# EAGLE design mw_itb_half_v1.7.2 (EAGLE 6.4)
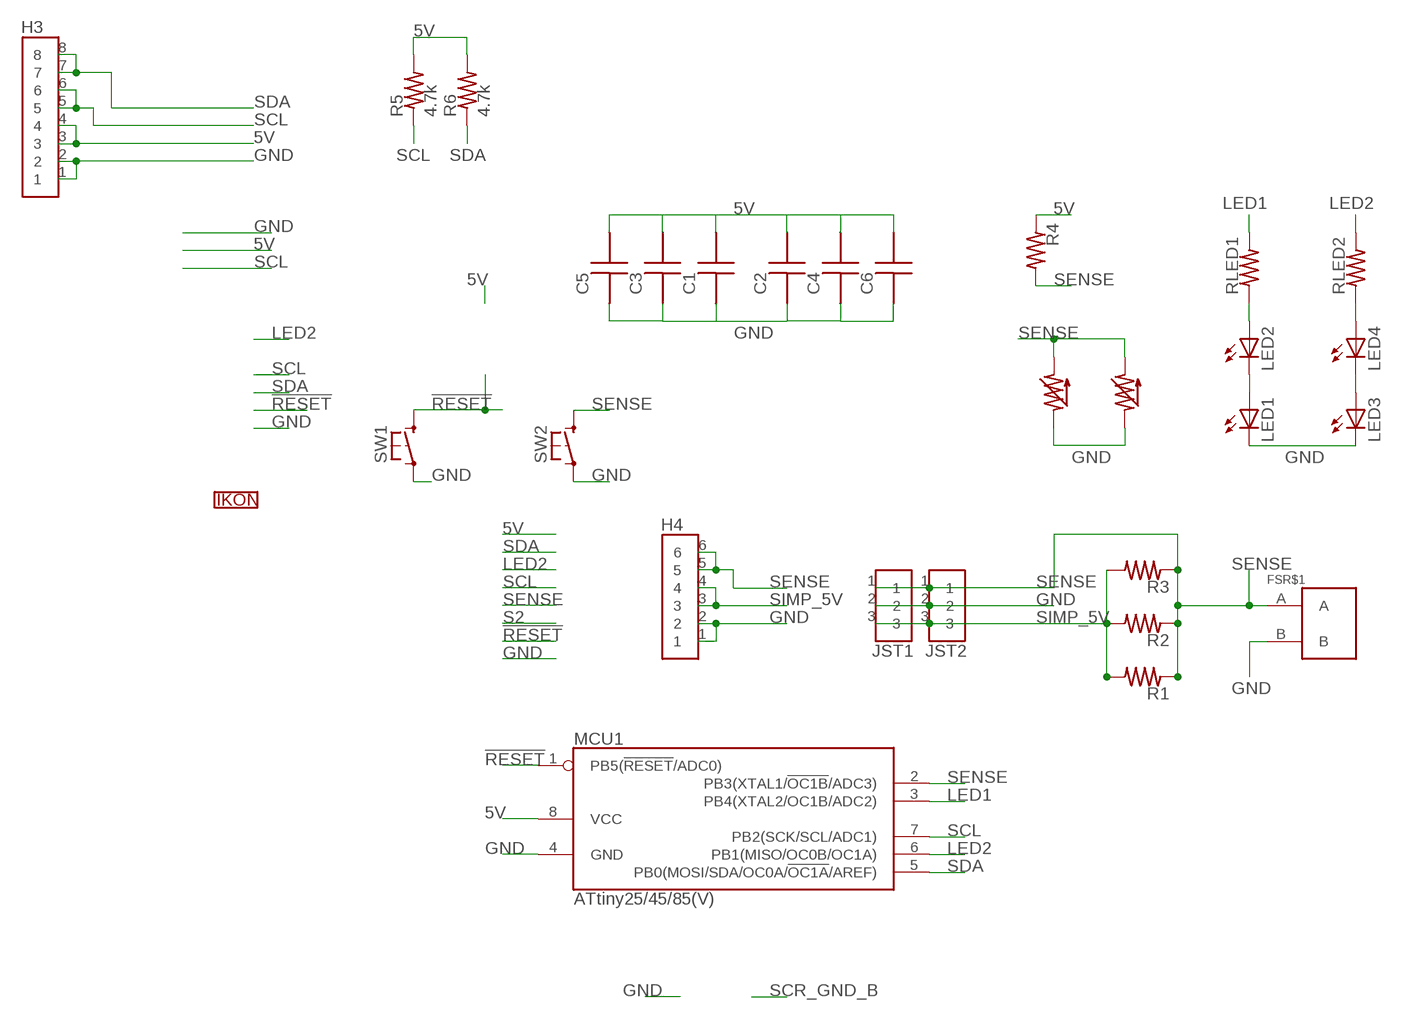
[diagram p0: schematic, sheet 1]

## Parts
C1  CAPACITOR1206  [1206_YAGEO]
C2  CAPACITOR1206  [1206_YAGEO]
C3  CAPACITOR0805  [0805_YAGEO]
C4  CAPACITOR0805  [0805_YAGEO]
C5  CAPACITOR0603  [0603_YAGEO]
C6  CAPACITOR0603  [0603_YAGEO]
FSR$1  FSR_PAD88X44_P2B  [FSR_PAD_88X44_P2B]
H3  HEADER_8P-0.1"_2X4-SMD-SULLINS  [HEADER-0.1"_2X4-SMD-SULLINS]
H4  HEADER_6P-0.1"_2X3-SMD-SULLINS  [HEADER-0.1"_2X3-SMD-SULLINS]
JST1  JST-3-PH-SMD-TOP  [JST_PH_SMD_3_TOP]
JST2  JST-3-PH-SMD-TOP  [JST_PH_SMD_3_TOP]
LED1  LED-ZBEND_RM  [Z-BEND_RM]
LED2  LED-ZBEND_RM  [Z-BEND_RM]
LED3  LED-ZBEND_RM  [Z-BEND_RM]
LED4  LED-ZBEND_RM  [Z-BEND_RM]
MCU1  ATMEL_ATTINY25/45/85(V)-SOIC_DUAL  [SOIC-8_DUAL]
R1  RESISTOR1206  [1206_YAGEO]
R2  RESISTOR0805  [0805_YAGEO]
R3  RESISTOR0603  [0603_YAGEO]
R4  RESISTOR0603  [0603_YAGEO]
R5  4.7k  RESISTOR0603  [0603_YAGEO]
R6  4.7k  RESISTOR0603  [0603_YAGEO]
RLED1  RESISTOR0603  [0603_YAGEO]
RLED2  RESISTOR0603  [0603_YAGEO]
SW1  SWITCH_SPST-KMT0  [KMT0]
SW2  SWITCH_SPST-KMT0  [KMT0]
U$5  FSR_PLACE  FSR_PLACE1.5"SQR  [FSR_1.5[IN]_SQR]
U$6  FSR_PLACE  FSR_PLACE1.5"SQR  [FSR_1.5[IN]_SQR]
U$9  FSR_PINS  FSR_PINSJUMBO_SMD  [FSR_0.1"-PITCH_PADS-0.05"X0.5"]
U$10  FSR_PINS  FSR_PINSJUMBO_SMD  [FSR_0.1"-PITCH_PADS-0.05"X0.5"]
U$11  IKONLEARNING-20MIL  [IKON_LEARNING_20MIL]

## Nets
5V: C1.1 C2.1 C3.1 C4.1 C5.1 C6.1 H3.3 H3.4 MCU1.8(VCC) R4.1 R5.2 R6.2
!RESET: MCU1.1(PB5(!RESET!/ADC0)) SW1.1@1 SW1.1@2
GND: C1.2 C2.2 C3.2 C4.2 C5.2 C6.2 FSR$1.B H3.1 H3.2 H4.1 H4.2 JST1.2 JST2.2 LED1.K(C) LED3.K(C) MCU1.4(GND) SW1.2@1 SW1.2@2 SW2.2@1 SW2.2@2 U$9.P$2 U$10.P$1
LED1: MCU1.3(PB4(XTAL2/OC1B/ADC2)) RLED1.2
LED2: MCU1.6(PB1(MISO/OC0B/OC1A)) RLED2.2
N$1: LED2.A RLED1.1
N$2: LED1.A LED2.K(C)
N$3: LED4.A RLED2.1
N$4: LED3.A LED4.K(C)
SCL: H3.5 H3.6 MCU1.7(PB2(SCK/SCL/ADC1)) R5.1
SDA: H3.7 H3.8 MCU1.5(PB0(MOSI/SDA/OC0A/!OC1A!/AREF)) R6.1
SENSE: FSR$1.A H4.5 H4.6 JST1.1 JST2.1 MCU1.2(PB3(XTAL1/!OC1B!/ADC3)) R1.1 R2.1 R3.1 R4.2 SW2.1@1 SW2.1@2 U$9.P$1 U$10.P$2
SIMP_5V: H4.3 H4.4 JST1.3 JST2.3 R1.2 R2.2 R3.2

## Library data of the parts
C1-C6 = NaN:CAPACITOR
FSR$1 = NaN:FSR_PAD
H3 = NaN:HEADER_8P
H4 = NaN:HEADER_6P
JST1 JST2 = NaN:JST-3
LED1-LED4 = NaN:LED: LEDs
MCU1 = NaN:ATMEL_ATTINY25/45/85(V)
R1-R6 RLED1 RLED2 = NaN:RESISTOR
SW1 SW2 = NaN:SWITCH_SPST
U$5 U$6 = NaN:FSR_PLACE
U$9 U$10 = NaN:FSR_PINS
U$11 = NaN:IKON

## Board
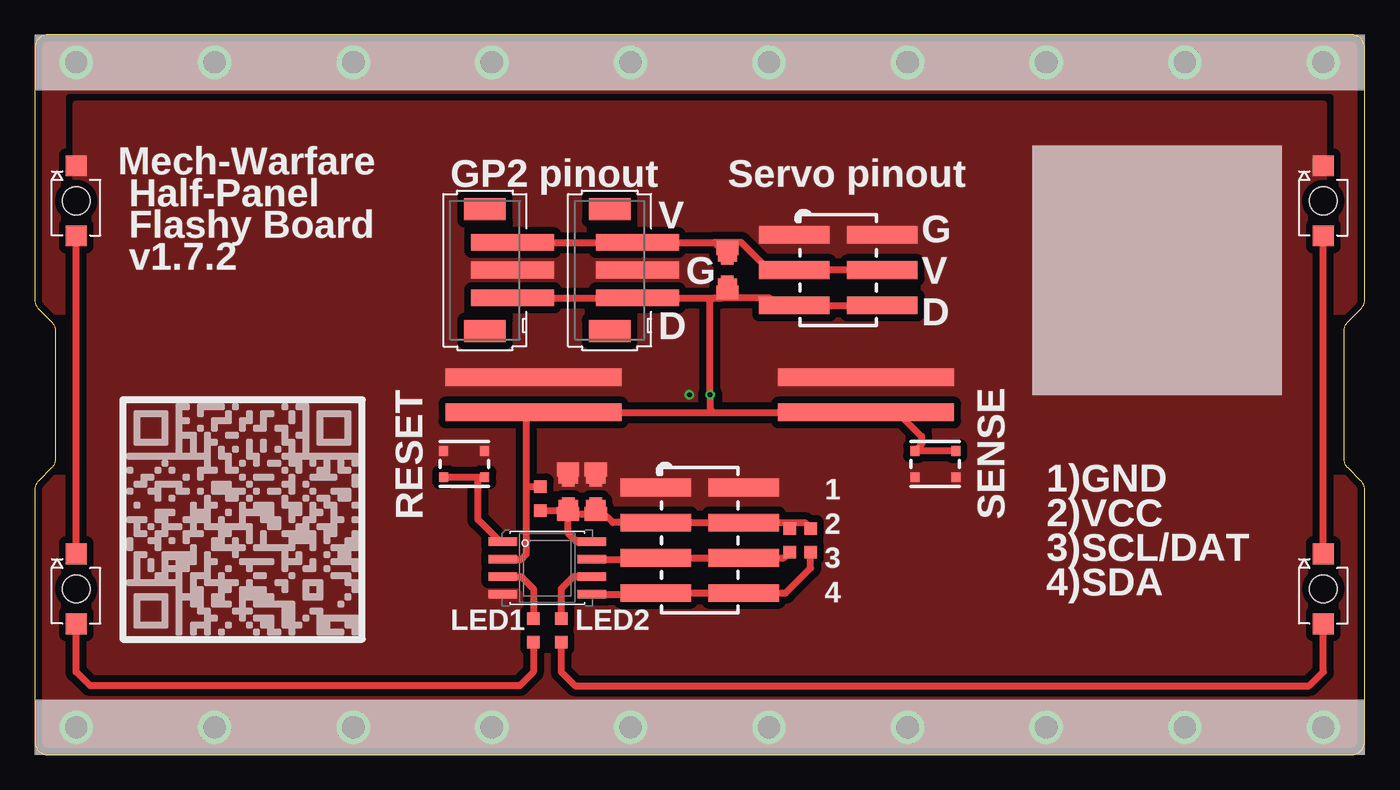
[diagram p1: board, top side]
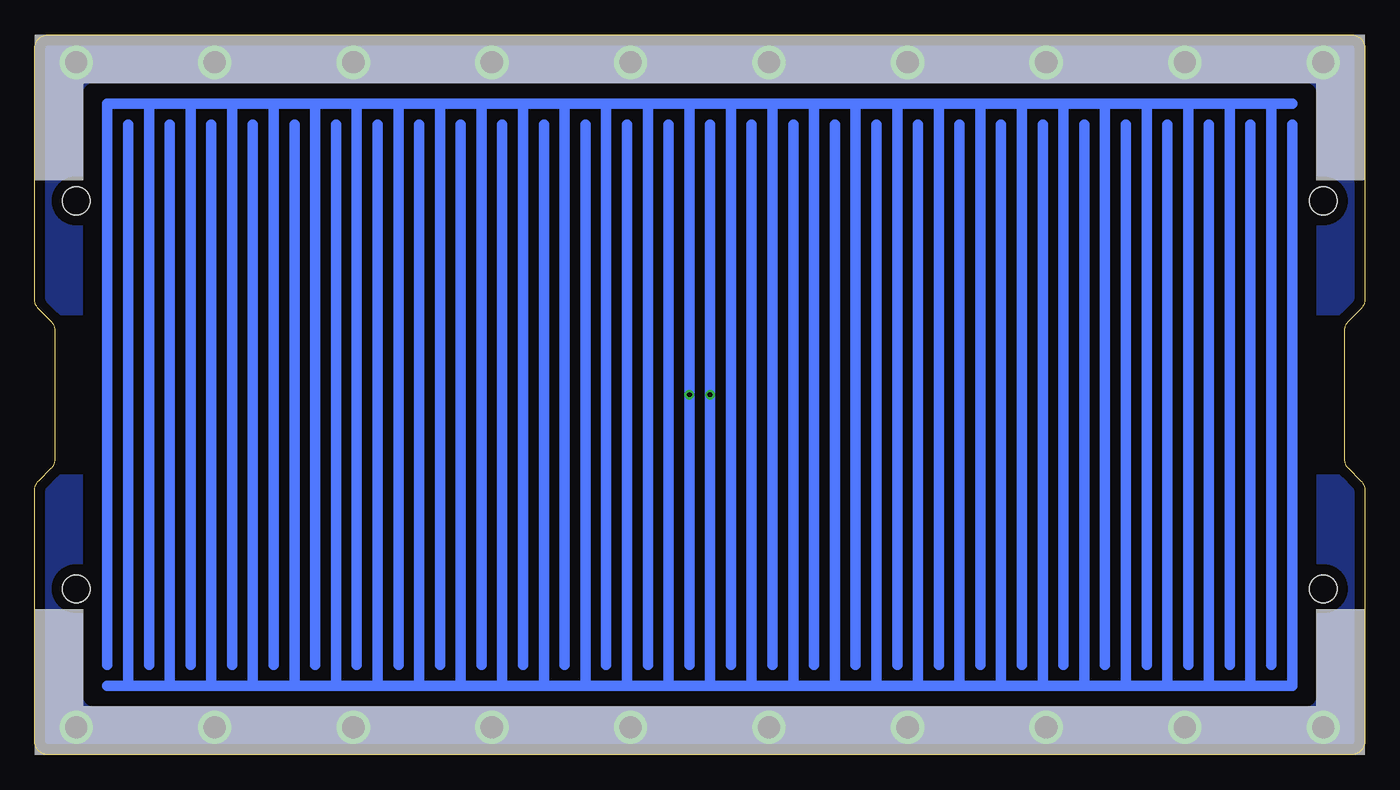
[diagram p2: board, bottom side, seen from below]

Size 96 x 52 mm. Coordinates in mm from the lower left corner, seen from the top.
Outline: 94.5,21.41 94.5,30.59 arc-45 94.79,31.29 95.71,32.21 arc45 96,32.91 96,51 arc90 95,52 1,52 arc90 0,51 0,32.91 arc45 0.29,32.21 1.21,31.29 arc-45 1.5,30.59 1.5,21.41 arc-45 1.21,20.71 0.29,19.79 arc45 0,19.09 0,1 arc90 1,0 95,0 arc90 96,1 96,19.09 arc45 95.71,19.79 94.79,20.71 arc-45 94.5,21.41
Copper layers (1*16): Top 0.0356mm / dielectric 1.5011mm / Bottom 0.0356mm
Design rules "LaenPCBOrder_mod": minimum track width 6mil, minimum drill 13mil, track to track 6mil, track to pad 6mil, pad to pad 6mil, via to via 6mil, smd to smd 0mil, copper to edge 15mil, drill to drill 6mil, minimum pad ring 7mil, minimum via ring 7mil, stop-mask expansion 4mil, vias tented up to drill 75mil, thermal gap 10mil

### Footprints (pad centres in the part's own frame; a part is rotated, then mirrored left to right if it is on the bottom)
1206_YAGEO = smd 1.6 x 1: 1 0,1.6; 2 0,-1.6
0805_YAGEO = smd 1.4 x 0.9: 1 0,1.05; 2 0,-1.05
0603_YAGEO = smd 0.9 x 0.9: 1 0,0.85; 2 0,-0.85
FSR_PAD_88X44_P2B = drill 0.35: A 0.75,0; B -0.75,0
HEADER-0.1"_2X4-SMD-SULLINS = smd 1.27 x 5.08: 1 -3.81,-3.175; 2 -3.81,3.175; 3 -1.27,-3.175; 4 -1.27,3.175; 5 1.27,-3.175; 6 1.27,3.175; 7 3.81,-3.175; 8 3.81,3.175
HEADER-0.1"_2X3-SMD-SULLINS = smd 1.27 x 5.08: 1 -2.54,-3.175; 2 -2.54,3.175; 3 0,-3.175; 4 0,3.175; 5 2.54,-3.175; 6 2.54,3.175
JST_PH_SMD_3_TOP = smd 1.2 x 6: 1 -2,-3.5; 2 0,-3.5; 3 2,-3.5 | smd 1.6 x 3: MNT@1 -4.4,-1.5; MNT@2 4.4,-1.5
Z-BEND_RM = smd 1.5 x 1.5: A -2.525,0; K 2.525,0 | hole 2: 0,0
SOIC-8_DUAL = smd 2.075 x 0.61: 1 -3.212,1.905; 2 -3.212,0.635; 3 -3.212,-0.635; 4 -3.212,-1.905; 5 3.212,-1.905; 6 3.212,-0.635; 7 3.212,0.635; 8 3.212,1.905
KMT0 = smd 0.65 x 0.7: 1@1 -1.475,0.95; 1@2 1.475,0.95; 2@1 -1.475,-0.95; 2@2 1.475,-0.95
FSR_0.1"-PITCH_PADS-0.05"X0.5" = smd 1.27 x 12.7: P$1 -1.27,0; P$2 1.27,0

### Placement (x,y rotation side)
C1  40.5,19 180 top
C2  38.5,19 180 top
C3  40.5,19 180 top
C4  38.5,19 180 top
C5  40.5,19 180 top
C6  38.5,19 180 top
FSR$1  48,26 0 top
H3  48,15.5 270 top
H4  58,35 270 top
JST1  31,35 90 top
JST2  40,35 90 top
LED1  3,40 90 top
LED2  3,12 90 top
LED3  93,40 90 top
LED4  93,12 90 top
MCU1  37,13.5 0 top
R1  50,35 180 top
R2  50,35 180 top
R3  50,35 180 top
R4  36.5,18.5 180 top
R5  54.5,15.5 180 top
R6  56,15.5 180 top
RLED1  36,9 180 top
RLED2  38,9 180 top
SW1  31,21 180 top
SW2  65,21 0 top
U$5  26,26 90 bottom
U$6  70,26 270 bottom
U$9  36,26 90 top
U$10  60,26 270 top
U$11  15,17 0 top

### Tracks (layer width: path | path; a pad name or v marks a point on that pad's centre or on a via)
5V
  Top 0.5: C2.1 C1.1 | C2.1 C4.1 C6.1 | C5.1 C3.1 C1.1 | 38.4,17.5 C2.1 | R4.1 38.25,17.65 C2.1 | MCU1.8 39.09,15.4 38.5,16 C2.1 | 54.5,16.77 H3.4 H3.3 41.73,16.77 41,17.5 40.6,17.5 C1.1 | 54.5,16.77 55.58,16.77 R6.2 | R5.2 54.5,16.77
!RESET
  Top 0.5: SW1.1@2 SW1.1@1 32.42,20 32,20 32,17 33.59,15.4 MCU1.1
GND
  pour Top (isolate 0.5, rank 2, no thermals): 3,5 3,47 93,47 93,5
LED1
  Top 0.5: MCU1.3 35.13,12.87 36,12 RLED1.2
LED2
  Top 0.5: MCU1.6 38.87,12.87 38,12 RLED2.2
N$1
  Top 0.5: RLED1.1 36,6 35,5 4,5 3,6 LED2.A
N$2
  Top 0.5: LED2.K LED1.A
N$3
  Top 0.5: RLED2.1 38,6 39,5 92,5 93,6 LED4.A
N$4
  Top 0.5: LED4.K LED3.A
SCL
  Top 0.5: R5.1 54.08,14.23 H3.6 H3.5 44.73,14.13 MCU1.7
SCR_GND_B  (via drill 1.6)
  other vias: 3,2 13,2 23,2 33,2 43,2 53,2 63,2 73,2 83,2 93,2
  pour Top (isolate 0.5, rank 6, no thermals): 0,0 0,20 96,20 96,0
  pour Bottom (isolate 0.75, rank 6, no thermals): 0,0 0,20 96,20 96,0
SCR_GND_T  (via drill 1.6)
  other vias: 3,50 13,50 23,50 33,50 43,50 53,50 63,50 73,50 83,50 93,50
  pour Bottom (isolate 0.75, rank 6, no thermals): 0,32 0,52 96,52 96,32
  pour Top (isolate 0.5, rank 6, no thermals): 0,32 0,52 96,52 96,32
SDA
  Top 0.5: R6.1 56,13.5 54.19,11.69 H3.8 H3.7 44.73,11.6 MCU1.5
SENSE
  Top 0.5: R2.1 49.95,34 49.95,34.1 R3.1 | 50.05,34 R2.1 | R2.1 R1.1 49.6,33 | 49,24.73 U$9.P$1 35.5,24.23 35.5,19.5 | 49,24.73 U$10.P$2 62.27,24.73 64,23 64,22.43 SW2.1@1 SW2.1@2 | 49,24.73 48.75,24.98 FSR$1.A 48.75,32.75 49,33 | MCU1.2 35.13,14.13 35.5,14.5 35.5,19.5 | R4.2 35.65,19.35 35.5,19.5 | 49,33 JST2.1 JST1.1 | 49,33 49.6,33 | 49.6,33 53,33 53.54,32.46 H4.5 H4.6
SIMP_5V
  Top 0.5: R2.2 R1.2 | 49.05,37 JST2.3 JST1.3 | 49.05,37 R2.2 | 49.05,37 51,37 53,35 H4.3 H4.4 | R3.2 R2.2

### Text on the board
tPlace: GP2 pinout | Servo pinout | V | G | Mech-Warfare / Half-Panel / Flashy Board / v1.7.2 | G | V | D | D | 1)GND | RESET | SENSE | 2)VCC | 3)SCL/DAT | 4)SDA | 1 / 2 / 3 / 4 | LED1 | LED2